# Altium schematic sheet Information.SchDoc: Information
size A3; Date: 05.10.2017; CheckedBy: Nico Bieberich; Author: Nico Bieberich; Organization: Baltic Racing; Address1: Zur Schwedenschanze 15; Address2: Haus 18; Address3: 18435 Stralsund; DocumentNumber: 1; Revision: xx.xx; SheetNumber: 1; SheetTotal: 2; Rules: TODO; ProjectName: Projekt
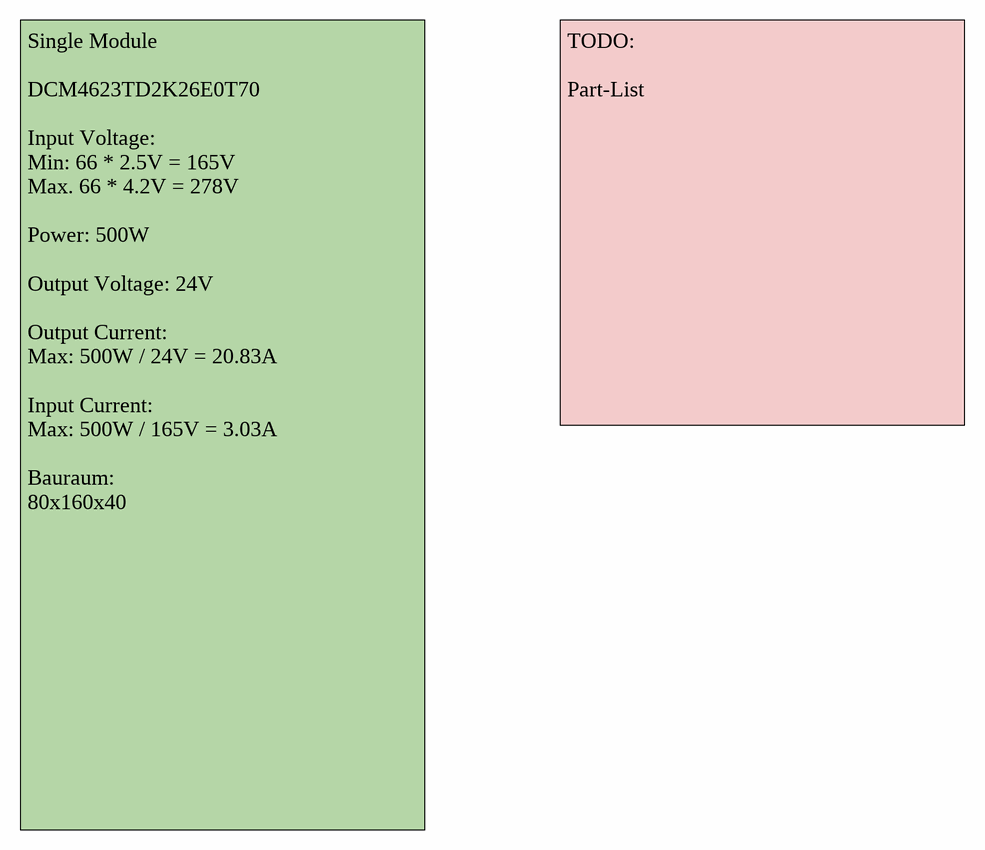
[diagram p0: Information.SchDoc]

## Notes on the sheet
- TODO:
  Part-List
- Single Module
  DCM4623TD2K26E0T70
  Input Voltage:
  Min: 66 * 2.5V = 165V
  Max. 66 * 4.2V = 278V
  Power: 500W
  Output Voltage: 24V
  Output Current:
  Max: 500W / 24V = 20.83A
  Input Current:
  Max: 500W / 165V = 3.03A
  Bauraum:
  80x160x40
- Title:
- Projekt:
- Revision:
- Author:
- Rules:
- Checked by:
- Sheet
- of
- Size:
- A4
- Date:
- Time: